# Altium schematic sheet Ethernet.SchDoc
size A4; SheetNumber: 3; SheetTotal: 11
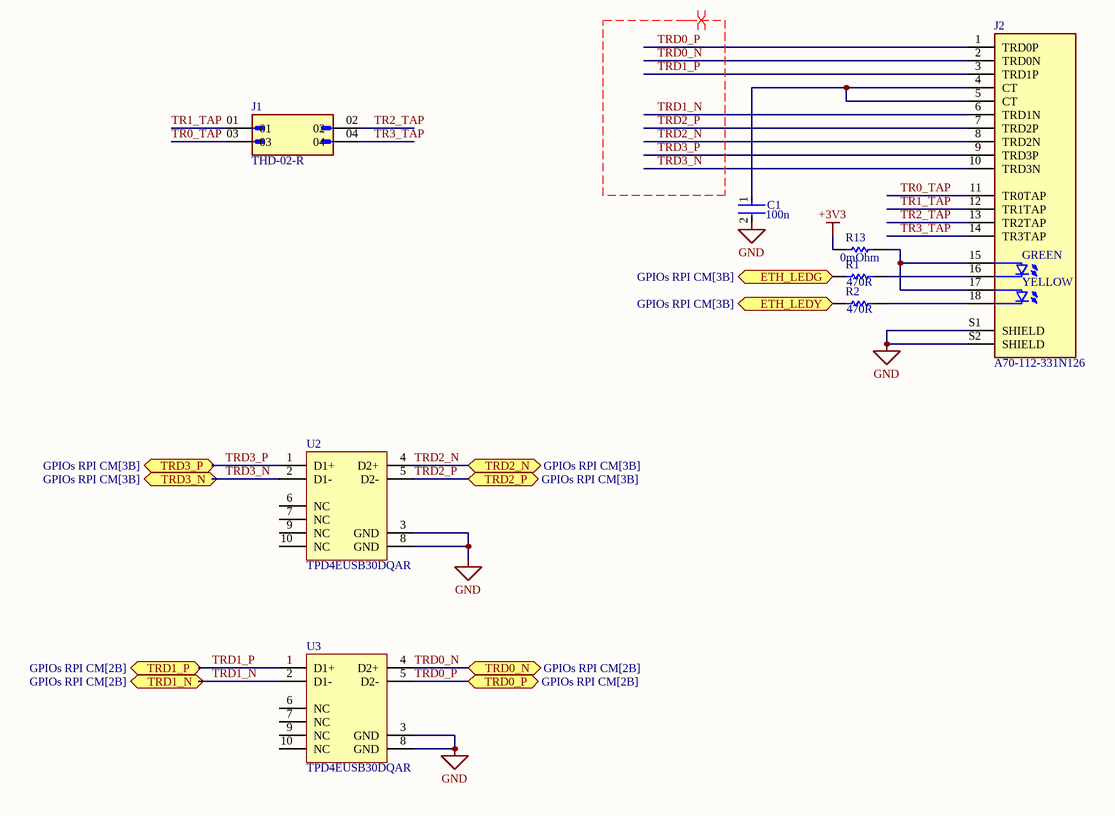
[diagram p0: Ethernet.SchDoc]

## Parts
C1  Capacitance: 100n  [FP-C0402-BB-MFG]  (hidden comment: C0402C104K8PACTU)
J1  THD-02-R  [VALCON_THD-02-R]
J2  A70-112-331N126  [EDAC_A70-112-331N126]
R1  value 470R  [RESC2013X50X30LL20T20]  (hidden comment: CRCW0805470RFKEA)
R2  value 470R  [RESC2013X50X30LL20T20]  (hidden comment: CRCW0805470RFKEA)
R13  Resistance: 0mOhm  [RESC1005X40X25LL05T05]  (hidden comment: ERJ2GE0R00X)
U2  TPD4EUSB30DQAR  [DQA0010A_V]
U3  TPD4EUSB30DQAR  [DQA0010A_V]

## Ports
ETH_LEDG (bidir, see GPIOs RPI CM[3B]), ETH_LEDY (bidir, see GPIOs RPI CM[3B]), TRD0_N (bidir, see GPIOs RPI CM[2B]), TRD0_P (bidir, see GPIOs RPI CM[2B]), TRD1_N (bidir, see GPIOs RPI CM[2B]), TRD1_P (bidir, see GPIOs RPI CM[2B]), TRD2_N (bidir, see GPIOs RPI CM[3B]), TRD2_P (bidir, see GPIOs RPI CM[3B]), TRD3_N (bidir, see GPIOs RPI CM[3B]), TRD3_P (bidir, see GPIOs RPI CM[3B])

## Nets
+3V3: R13.1
GND: C1.2 J2.S1(SHIELD) J2.S2(SHIELD) U2.3(GND) U2.8(GND) U3.3(GND) U3.8(GND)
ETH_LEDG: R1.1 ; port ETH_LEDG
ETH_LEDY: R2.1 ; port ETH_LEDY
TR0_TAP: J1.03 J2.11(TR0TAP)
TR1_TAP: J1.01 J2.12(TR1TAP)
TR2_TAP: J1.02 J2.13(TR2TAP)
TR3_TAP: J1.04 J2.14(TR3TAP)
TRD0_N: J2.2(TRD0N) U3.4(D2+) ; port TRD0_N
TRD0_P: J2.1(TRD0P) U3.5(D2-) ; port TRD0_P
TRD1_N: J2.6(TRD1N) U3.2(D1-) ; port TRD1_N
TRD1_P: J2.3(TRD1P) U3.1(D1+) ; port TRD1_P
TRD2_N: J2.8(TRD2N) U2.4(D2+) ; port TRD2_N
TRD2_P: J2.7(TRD2P) U2.5(D2-) ; port TRD2_P
TRD3_N: J2.10(TRD3N) U2.2(D1-) ; port TRD3_N
TRD3_P: J2.9(TRD3P) U2.1(D1+) ; port TRD3_P
NetC1_1: C1.1 J2.4(CT) J2.5(CT)
NetJ2_15: J2.15(Anode) J2.17(Anode) R13.2
NetJ2_16: J2.16(Cathode) R1.2
NetJ2_18: J2.18(Cathode) R2.2

Not connected (* = marked no-connect by the designer): U2 6(NC) 7(NC) 9(NC) 10(NC); U3 6(NC) 7(NC) 9(NC) 10(NC)

## Layout directives
differential pair: TRD0_N, TRD0_P, TRD1_N, TRD1_P, TRD2_N, TRD2_P, TRD3_N, TRD3_P

## Notes on the sheet
- (in symbol A70-112-331N126) GREEN; YELLOW

## Library data of the parts
C1 = CMP-2008-02046-2: CAP CER 0.1UF 10V X5R 0402; Manufacturer: Kemet; Material: Ceramic; Temperature Coefficient: 15%; Tolerance: 0.1; Value: 0.10 μF; Package: C0402-BB; Temperature: -55°C to +125°C; ComponentLink2Description: Datasheet; Temperature Characteristic: X5R; Device Class L1: Passive Components; Height: 0.55mm; Lead Free: Yes; ComponentLink2URL: https://content.kemet.com/datasheets/KEM_C1002_X7R_SMD.pdf; Device Class L2: Capacitors; Temperature Range Low: -55°C; Temperature Range High: +125°C; RoHS: TRUE; Octopart: https://octopart.com/c0402c104k8pactu-kemet-140039; Automotive: No; Mouser Description: Capacitor 100 nF 10 VDC 0402; Category: Cap; Voltage Rating: 10 V; Digikey Description: CAP CER 0.1UF 10V X5R 0402; Ipc Land Pattern Name: CAPC10050X50; Device Class L3: Ceramic Capacitors; Manufacturer Part Number: C0402C104K8PACTU
J1 = THD-02-R: THD - Valcon 2.54mm Pitch Dual Row Pin Header - Fast Stock; Check_prices: https://www.snapeda.com/parts/THD-02-R/Valcon/view-part/4777189/?ref=eda; Package: None; Purchase-URL: https://pricing.snapeda.com/search/part/THD-02-R/?ref=eda; MP: THD-02-R; Value: *; Availability: No availability data; SnapEDA_Link: https://www.snapeda.com/parts/THD-02-R/Valcon/view-part/4777189/?ref=snap; Price: None; MF: Valcon
J2 = A70-112-331N126: Ethernet RPI; Package: None; Availability: Unavailable; MP: A70-112-331N126; Value: *; Price: None
R1 R2 = CMP-2001-03932-1: Manufacturer: Vishay Dale; Part Number: CRCW0805470RFKEA
R13 = CMP-2000-07451-1: Chip Resistor, 0 Ohm, 0.1 W, -55 to 155 degC, 0402 (1005 Metric), RoHS, Tape and Reel; Manufacturer: Panasonic; Voltage Rating (DC): 50V; Temperature Coefficient: 600ppm/��C; Max Power Dissipation: 100mW; Tolerance: 5%; Number of Terminations: 2; Mount: SurfaceMount; Height: 0.35mm; Packaging: TapeandReel; Contact Plating: Tin; Manufacturer URL: http://www.panasonic.com/; Composition: ThickFilm; Max Operating Temperature: 155degC; REACH SVHC: NoSVHC; Case/Package: 0402; Package Reference: 402; Depth: 0.5mm; Package Description: 2-Pin Surface Mount Device, Body 1 x 0.5 mm; Datasheet URL: https://industrial.panasonic.com/cdbs/www-data/pdf/RDA0000/AOA0000C301.pdf; RoHSCompliant: True; Case Code (Imperial): 0402; Military Standard: Not; Min Operating Temperature: -55degC; Power Rating: 100mW; Datasheet Version: 03/2015; Length: 1mm; Case Code (Metric): 1005; Termination: SMD/SMT; Mounting Technology: SurfaceMount; Voltage Rating: 50V; Width: 0.02inch; Package Quantity: 1; Lead Free: LeadFree; Radiation Hardening: No
U2 U3 = CMP-0326-00027-3: ESD Solution for Super-Speed (6 GBPS) USB 3.0 Interface, 4 Channels, -40 to +85 degC, 10-pin SON (DQA), Green (RoHS & no Sb/Br); Manufacturer: Texas Instruments; Differential Capacitance(pF): 0.05; Serial ATA / eSATA: TRUE; IO Capacitance(Typ)(pF): 0.8; IO Leakage Current(nA): 10; IEC 61000-4-2 Air-Gap(+/- kV): 8; ComponentLink3Description: URL Link1; PartNumber: TPD4EUSB30DQAR; DatasheetVersion: SLVSAC2C; ComponentLink2URL: http://www.ti.com/general/docs/lit/getliterature.tsp?genericPartNumber=TPD4EUSB30&fileType=pdf; USB Super Speed: TRUE; Eco-Plan: Green (RoHS & no Sb/Br); Mounting Technology: Surface Mount; 1394 / Firewire: TRUE; PackageVersion: revB, Sep-2009; SubFamily: ESD Solution; USB Full Speed: TRUE; USB High Speed: TRUE; ComponentLink2Description: Datasheet; ComponentLink1URL: http://www.ti.com/; IEC 61000-4-2 Contact(+/- kV): 8; Breakdown Voltage(Min)(V): 8; PackageReference: DQA0010A; ComponentLink1Description: Manufacturer URL; PackageDescription: 10-Pin Plastic Small Outline No-Lead, 1 x 2.5 x 0.55 mm Body, 0.5 mm Pitch; ComponentLink3URL: SamplesURL:http://www.ti.com/product/tpd4eusb30#samples; HDMI: TRUE